# EAGLE design mdbt42q_beacon (EAGLE 7.7.0)
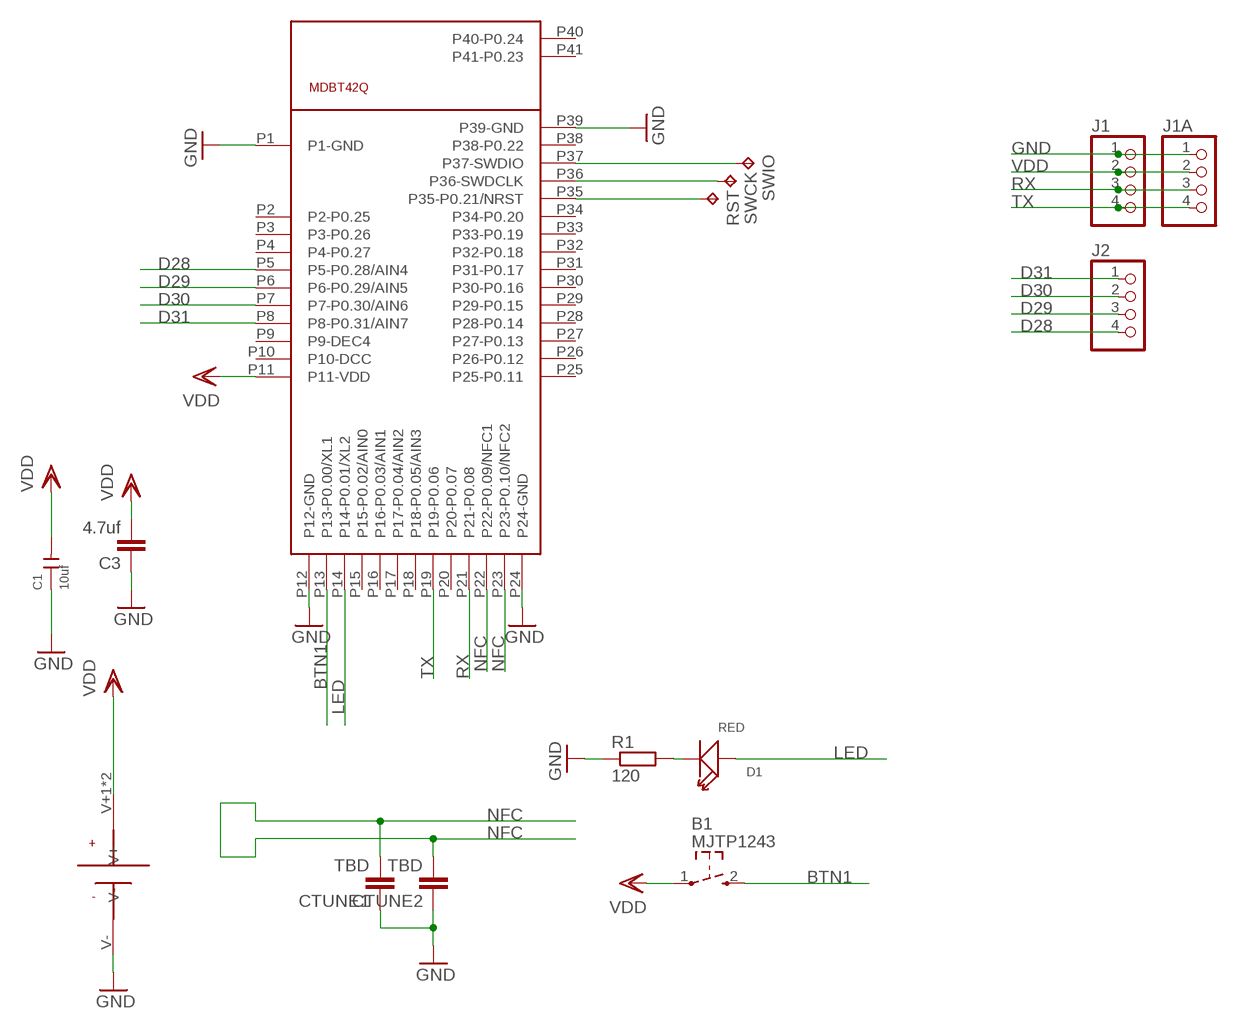
[diagram p0: schematic, sheet 1]

## Parts
B1  MJTP1243  [MJTP1243]
C1  10uf  CERAMIC-47UF-6.3V-20%-X5R(0805)  [C0805]
C3  4.7uf  C-EUC0603  [C0603]
CTUNE1  TBD  C-EUC0603  [C0603]
CTUNE2  TBD  C-EUC0603  [C0603]
D1  RED  SMD-LED-CLEAR-BLUE(0603)  [LED-0603]
J1  PINHD-1X04_2.54-S  [1X04-S]
J1A  PINHD-1X04  [1X04M2]
J2  PINHD-1X04_2.54-S  [1X04-S]
J8  KEYSTONE-3003  [KEYSTONE-3003]
R1  120  R-EU_R0603  [R0603]
RST  TPTP15R  [TP15R]
SWCK  TPTP15R  [TP15R]
SWIO  TPTP15R  [TP15R]
U1  MDBT42Q  [MDBT40]

## Nets
BTN1: B1.2 U1.P13(P13-P0.00/XL1)
D28: J2.4 U1.P5(P5-P0.28/AIN4)
D29: J2.3 U1.P6(P6-P0.29/AIN5)
D30: J2.2 U1.P7(P7-P0.30/AIN6)
D31: J2.1 U1.P8(P8-P0.31/AIN7)
GND: C1.1 C3.1 CTUNE1.1 CTUNE2.1 J1.1 J1A.1 J8.V- R1.1 U1.P1(P1-GND) U1.P12(P12-GND) U1.P24(P24-GND) U1.P39(P39-GND)
LED: D1.+ U1.P14(P14-P0.01/XL2)
N$1: D1.- R1.2
N$5: SWCK.TP U1.P36(P36-SWDCLK)
N$6: SWIO.TP U1.P37(P37-SWDIO)
N$14: RST.TP U1.P35(P35-P0.21/NRST)
NFC: CTUNE1.2 CTUNE2.2 U1.P22(P22-P0.09/NFC1) U1.P23(P23-P0.10/NFC2)
RX: J1.3 J1A.3 U1.P21(P21-P0.08)
TX: J1.4 J1A.4 U1.P19(P19-P0.06)
VDD: B1.1 C1.2 C3.2 J1.2 J1A.2 J8.V+1(V+) J8.V+2(V+) U1.P11(P11-VDD)
Unconnected: U1.P2(P2-P0.25) U1.P3(P3-P0.26) U1.P4(P4-P0.27) U1.P9(P9-DEC4) U1.P10(P10-DCC) U1.P15(P15-P0.02/AIN0) U1.P16(P16-P0.03/AIN1) U1.P17(P17-P0.04/AIN2) U1.P18(P18-P0.05/AIN3) U1.P20(P20-P0.07) U1.P25(P25-P0.11) U1.P26(P26-P0.12) U1.P27(P27-P0.13) U1.P28(P28-P0.14) U1.P29(P29-P0.15) U1.P30(P30-P0.16) U1.P31(P31-P0.17) U1.P32(P32-P0.18) U1.P33(P33-P0.19) U1.P34(P34-P0.20) U1.P38(P38-P0.22) U1.P40(P40-P0.24) U1.P41(P41-P0.23)

## Library data of the parts
B1 = Lowduino:MJTP1243
C1 = Seeed-OPL-Capacitor:CERAMIC-47UF-6.3V-20%-X5R(0805): 302010166; MPN: CC0805MKX5R5BB476; VALUE: 47uf
C3 CTUNE1 CTUNE2 = rcl:C-EU: CAPACITOR, European symbol
D1 = Seeed-OPL-Diode:SMD-LED-CLEAR-BLUE(0603): 304090045; MPN: 19-217-BHC-ZL1M2RY-3T; VALUE: BLUE-0603
J1 J1A J2 = pinhead-2:PINHD-1X04: PIN HEADER
J8 = cr2032:KEYSTONE-3003
R1 = rcl:R-EU_: RESISTOR, European symbol
RST SWCK SWIO = testpad:TP: Test pad
U1 = mdbt42:MDBT42Q

## Board
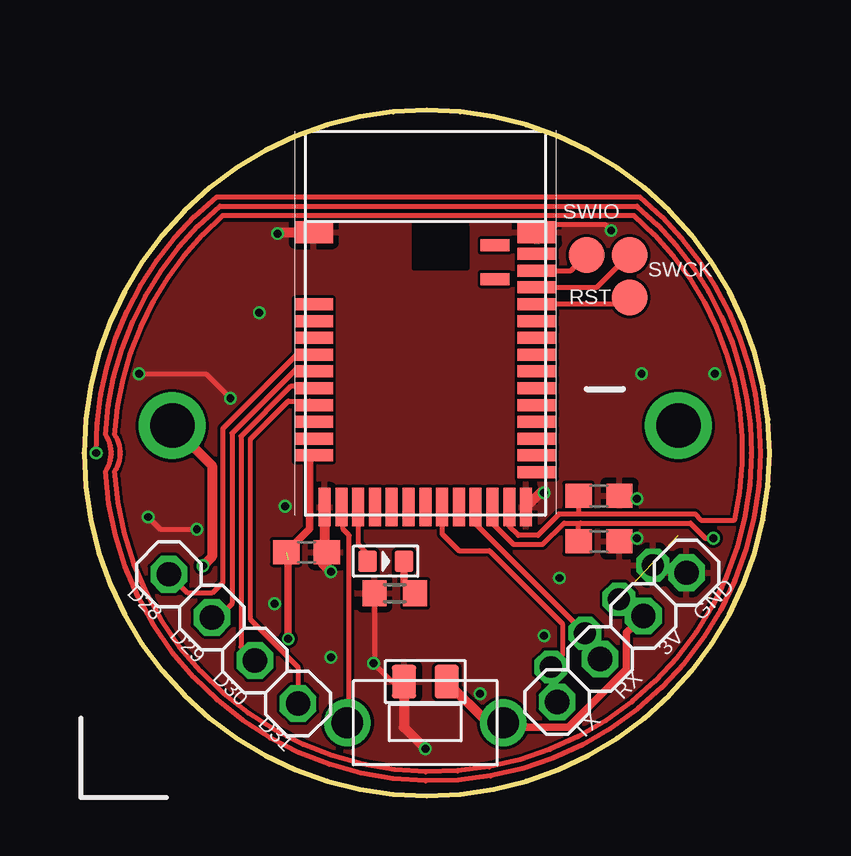
[diagram p1: board, top side]
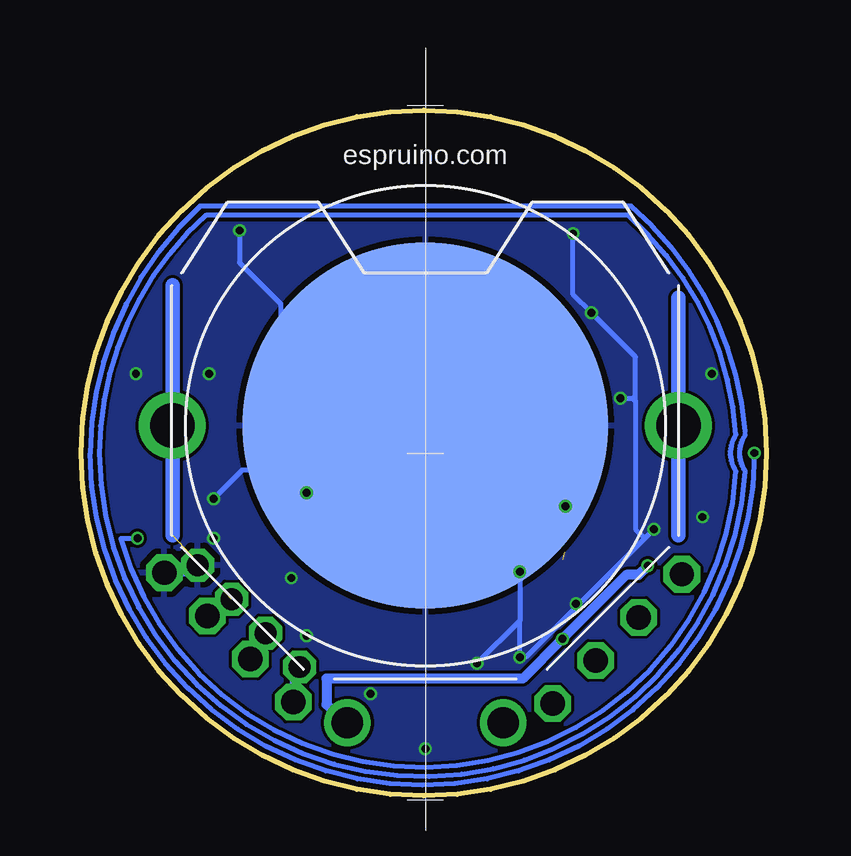
[diagram p2: board, bottom side, seen from below]

Size 28.58 x 28.57 mm. Coordinates in mm from the lower left corner, seen from the top.
Outline: 28.58,14.29 arc180 0,14.29 arc180 28.58,14.29
Copper layers (1*16): Top 0.035559375mm / dielectric 0.17018125mm / Bottom 0.035559375mm
Design rules "espruino": minimum track width 5mil, minimum drill 10mil, track to track 5mil, track to pad 5mil, pad to pad 5mil, via to via 5mil, smd to smd 0mil, copper to edge 4mil, drill to drill 6mil, minimum pad ring 4mil, minimum via ring 4mil, stop-mask expansion 4mil, vias tented up to drill 15mil, thermal gap 10mil

### Footprints (pad centres in the part's own frame; a part is rotated, then mirrored left to right if it is on the bottom)
MJTP1243 = drill 1.3: 1 -3.25,0; 2 3.25,0
C0805 = smd 1.397 x 1.016: 1 0,0.889; 2 0,-0.889
C0603 = smd 1.1 x 1: 1 -0.85,0; 2 0.85,0
LED-0603 = smd 0.762 x 0.889: + -0.762,0; - 0.762,0
1X04-S = drill 1.016 octagon: 1 -3.81,0; 2 -1.27,0; 3 1.27,0; 4 3.81,0
1X04M2 = drill 0.914 octagon: 1 -3,0; 2 -1,0; 3 1,0; 4 3,0
KEYSTONE-3003 = drill 1.854: V+1 -10.554,0; V+2 10.554,0 | smd 15.24 x 15.24: V- 0,0
R0603 = smd 1 x 1.1: 1 -0.85,0; 2 0.85,0
TP15R = smd 1.5 x 1.5: TP 0,0
MDBT40 = smd 1.6 x 0.9: P1 -4.65,3.8; P39 4.65,3.8 | smd 1.6 x 0.5: P2 -4.65,0.8; P3 -4.65,0.1; P4 -4.65,-0.6; P5 -4.65,-1.3; P6 -4.65,-2; P7 -4.65,-2.7; P8 -4.65,-3.4; P9 -4.65,-4.1; P10 -4.65,-4.8; P11 -4.65,-5.5; P25 4.65,-6.2; P26 4.65,-5.5; P27 4.65,-4.8; P28 4.65,-4.1; P29 4.65,-3.4; P30 4.65,-2.7; P31 4.65,-2; P32 4.65,-1.3; P33 4.65,-0.6; P34 4.65,0.1; P35 4.65,0.8; P36 4.65,1.5; P37 4.65,2.2; P38 4.65,2.9 | smd 0.5 x 1.6: P12 -4.2,-7.65; P13 -3.5,-7.65; P14 -2.8,-7.65; P15 -2.1,-7.65; P16 -1.4,-7.65; P17 -0.7,-7.65; P18 0,-7.65; P19 0.7,-7.65; P20 1.4,-7.65; P21 2.1,-7.65; P22 2.8,-7.65; P23 3.5,-7.65; P24 4.2,-7.65 | smd 1.2 x 0.5: P40 2.9,3.25; P41 2.9,1.85

### Placement (x,y rotation side)
B1  14.22,3.05 180 top
C1  14.22,4.76 90 top
C3  9.27,10.16 180 top
CTUNE1  21.46,12.51 180 top
CTUNE2  21.46,10.6 180 top
D1  12.57,9.78 0 top
J1  22.42,6.6 225 top
J1A  21.59,7.49 225 top
J2  6.22,6.54 135 top
J8  14.22,15.43 180 bottom
R1  12.95,8.45 0 top
RST  22.73,20.76 0 top
SWCK  22.73,22.54 0 top
SWIO  20.96,22.54 0 top
U1  14.22,19.68 0 top

### Tracks (layer width: path | path; a pad name or v marks a point on that pad's centre or on a via)
BTN1
  Top 0.203: 10.99,3.06 B1.2 11.05,3.12 11.05,10.86 10.79,11.11 10.79,11.96 U1.P13
D28
  Top 0.203: J2.4 4.32,8.45 5.33,8.45 5.78,8.89 5.78,15.3 8.86,18.38 U1.P5
D29
  Top 0.203: U1.P6 9.48,17.78 8.83,17.78 6.16,15.11 6.16,8 5.6,7.44 J2.3
D30
  Top 0.203: U1.P7 9.48,17.08 8.64,17.08 6.54,14.99 6.54,6.2 7.1,5.64 J2.2
D31
  Top 0.203: 8.89,3.87 J2.1 8.92,5.37 6.92,7.37 6.92,14.86 8.51,16.45 9.41,16.45 U1.P8
GND  (via drill 0.33)
  Top 0.203: U1.P39 19.36,23.49 19.69,23.81 21.72,23.81 v21.97,23.56 | C1.1 12.83,4.76 v12.06,5.52 12.13,5.59 12.13,8.42 R1.1 | v2.67,11.62 3.17,11.11 v4.7,11.11 | 13.33,2.86 13.33,2.96 | v2.29,17.59 5.08,17.59 v6.1,16.57 | 10.02,10.47 10.02,10.26 C3.1 9.97,10.01 9.97,9.65 | v23.05,10.73 22.44,10.73 CTUNE2.1 | v23.05,12.38 22.44,12.38 CTUNE1.1
  Top 0.406: U1.P24 19.03,12.64 v19.18,12.64 | C1.1 13.33,2.86 v14.22,1.97 | U1.P12 10.02,10.47 | 9.97,9.65 v10.29,9.33 | v8.06,23.43 8.12,23.49 U1.P1
  Bottom 0.203: 15.37,15.68 18.54,15.68 21.15,13.08 | 15.37,15.68 17.91,18.22 20.13,18.22 20.26,18.1 20.26,20.51 21.97,22.22 v21.97,23.56 | 21.15,13.08 21.27,12.95 20.89,12.57 | v19.18,12.64 19.5,12.95 19.69,12.76 | 10.29,7.3 v10.29,9.33 10.29,10.1 | 10.29,7.3 v12.06,5.52 | v19.18,12.64 19.18,11.18 17.78,9.78 17.53,9.78 | 20.13,13.59 v19.18,12.64 | 20.13,13.59 20.64,13.08 21.15,13.08 | 10.29,7.3 v10.29,5.78 10.03,5.78 5.08,10.73 | v4.7,11.11 5.08,10.73 | v8.06,23.43 8.06,20.89 v7.3,20.13 5.46,18.29 5.46,16.45 | 5.46,16.45 5.46,11.11 5.08,10.73 | 15.37,15.68 14.48,15.68 J8.V- | 23.75,9.65 J1A.1 | v6.1,16.57 5.59,16.57 5.46,16.45 | 20.13,13.59 21.84,13.59 v23.05,12.38 | 8.95,11.43 8.95,11.49 v8.38,12.07
  Bottom 0.305: J1A.1 24.03,9.3 J1.1 | 8.95,11.43 9.97,10.41 9.97,9.65 v10.29,9.33
  other vias: 7.94,8 16.51,4.25 26.29,17.59 23.24,17.59 19.18,6.67 19.81,9.08
  pour Top: -0.13,23.81 29.08,23.81 29.08,-0.06 -0.13,-0.06
  pour Bottom: -0.13,23.81 29.08,23.81 29.08,-0.06 -0.13,-0.06
LED
  Top 0.203: D1.+ 11.81,10.1 11.43,10.48 U1.P14
N$1
  Top 0.305: D1.- 13.33,8.91 R1.2
N$5
  Top 0.203: U1.P36 21.38,21.18 SWCK.TP
N$6
  Top 0.203: U1.P37 20.3,21.88 SWIO.TP
N$14
  Top 0.203: RST.TP 22.45,20.49 U1.P35
NFC  (via drill 0.33)  (1 unrouted)
  Top 0.203: U1.P23 17.72,11.24 18.1,10.86 18.92,10.86 19.81,11.75 20.57,11.75 | U1.P22 17.02,11.36 17.91,10.48 19.11,10.48 20,11.37 20.7,11.37 | 20.7,11.37 25.27,11.37 25.91,10.73 v26.23,10.73 | 20.57,11.75 25.46,11.75 25.72,11.49 27.11,11.49 arc62 22.92,24.19 5.78,24.19 arc45 1.27,15.05 arc-70 1.27,13.53 arc177 27.81,14.29 arc50 23.05,24.57 5.65,24.57 arc47 0.89,15.05 arc-70 0.89,13.53 arc177 28.19,14.29 arc50 23.18,24.96 5.53,24.96 arc52 v0.51,14.29 | CTUNE1.2 20.61,11.79 20.57,11.75 | CTUNE2.2 20.61,11.28 20.7,11.37
  Bottom 0.203: v0.51,14.29 arc180 28.19,14.29 arc47 23.62,24.57 5.65,24.57 arc45 0.89,15.18 | 0.89,15.05 arc-70 0.89,13.53 arc177 27.81,14.29 arc48 23.37,24.19 5.78,24.19 arc45 1.27,15.05 arc-70 1.27,13.53 arc161 26.92,10.73 v26.23,10.73
RX
  Top 0.203: U1.P21 16.32,11.34 J1A.3
  Bottom 0.305: J1A.3 21.52,6.15 J1.3
TX
  Top 0.203: U1.P19 14.92,10.92 15.62,10.22 16.89,10.22 19.94,7.18 19.94,5.84 J1A.4
  Bottom 0.305: J1A.4 19.72,5.12 J1.4
VDD  (via drill 0.33)  (2 unrouted)
  Top 0.203: 15.02,4.67 C1.2
  Top 0.305: J1.2 22.61,6.79 22.61,5.27 20.19,2.86 18.42,2.86 18.23,3.05 | U1.P11 9.57,14.21 9.4,14.03 9.4,11.14 C3.2 | 8.51,9.84 v8.51,6.54
  Top 0.406: C1.2 16.83,3.05 B1.1 18.23,3.05 | v4.95,9.59 5.33,9.97 5.33,13.77 J8.V+1
  Bottom 0.203: J8.V+2 24.78,13.41 24.77,13.4 | 3.68,10.86 J8.V+1
  Bottom 0.305: J1A.2 23,7.5 J1.2
  Bottom 0.406: v4.95,9.59 5.33,9.21 5.84,9.21 v8.51,6.54 10.16,4.89 18.35,4.89 18.35,3.81 17.59,3.05 B1.1
  Bottom 0.61: 3.68,20.76 3.68,10.86 | 24.77,21.27 24.77,13.4 24.77,10.86

### Text on the board
tNames: D28 | GND | D29 | 3V | D30 | RX | D31 | TX
bNames: espruino.com